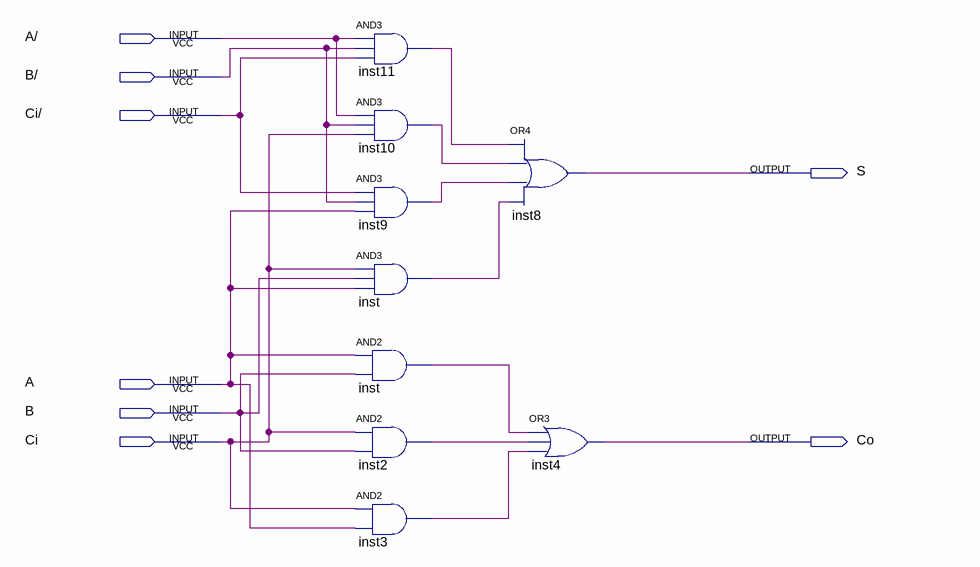
[diagram p0: schematic sheet]
// Quartus schematic fulladder_circuit.bdf as structural Verilog: 9 symbols, 8 pins
module fulladder_circuit (
  input  \A/ ,
  input  \B/ ,
  input  \Ci/ ,
  input  A,
  input  B,
  input  Ci,
  output S,
  output Co
);

  wire inst2_out, inst3_out, inst9_out, inst10_out, inst11_out, inst_out, inst_out_2;

  and inst11 (inst11_out, \A/ , \B/ , \Ci/ );
  and inst10 (inst10_out, \A/ , \B/ , Ci);
  and inst9 (inst9_out, \Ci/ , \B/ , A);
  and inst (inst_out_2, Ci, B, A);
  and inst_dup2 (inst_out, A, B);
  and inst2 (inst2_out, Ci, B);
  and inst3 (inst3_out, Ci, A);
  or inst8 (S, inst11_out, inst10_out, inst9_out, inst_out_2);
  or inst4 (Co, inst_out, inst2_out, inst3_out);
endmodule
